# EAGLE schematic Solo_MultiCharger (EAGLE 6.6.0)
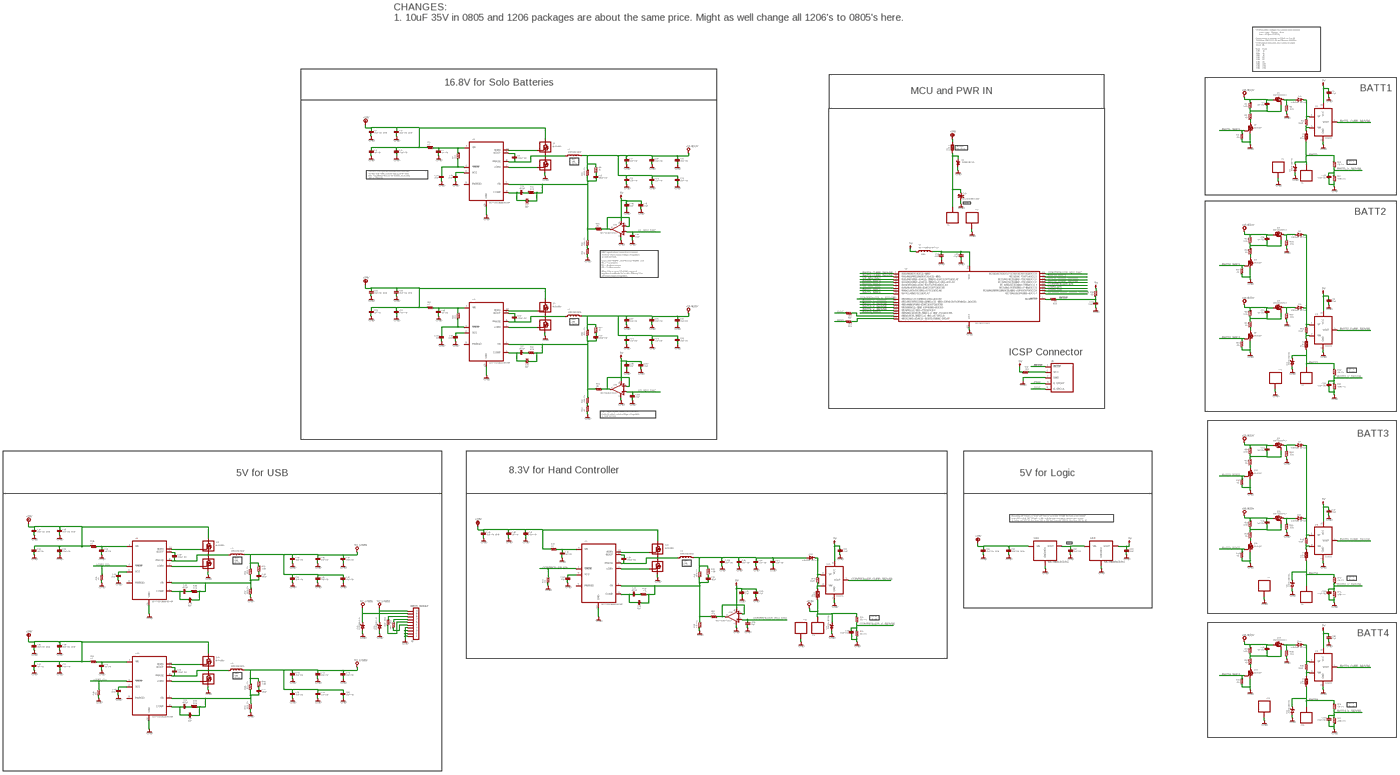
[diagram p0: schematic, sheet 1, overview]
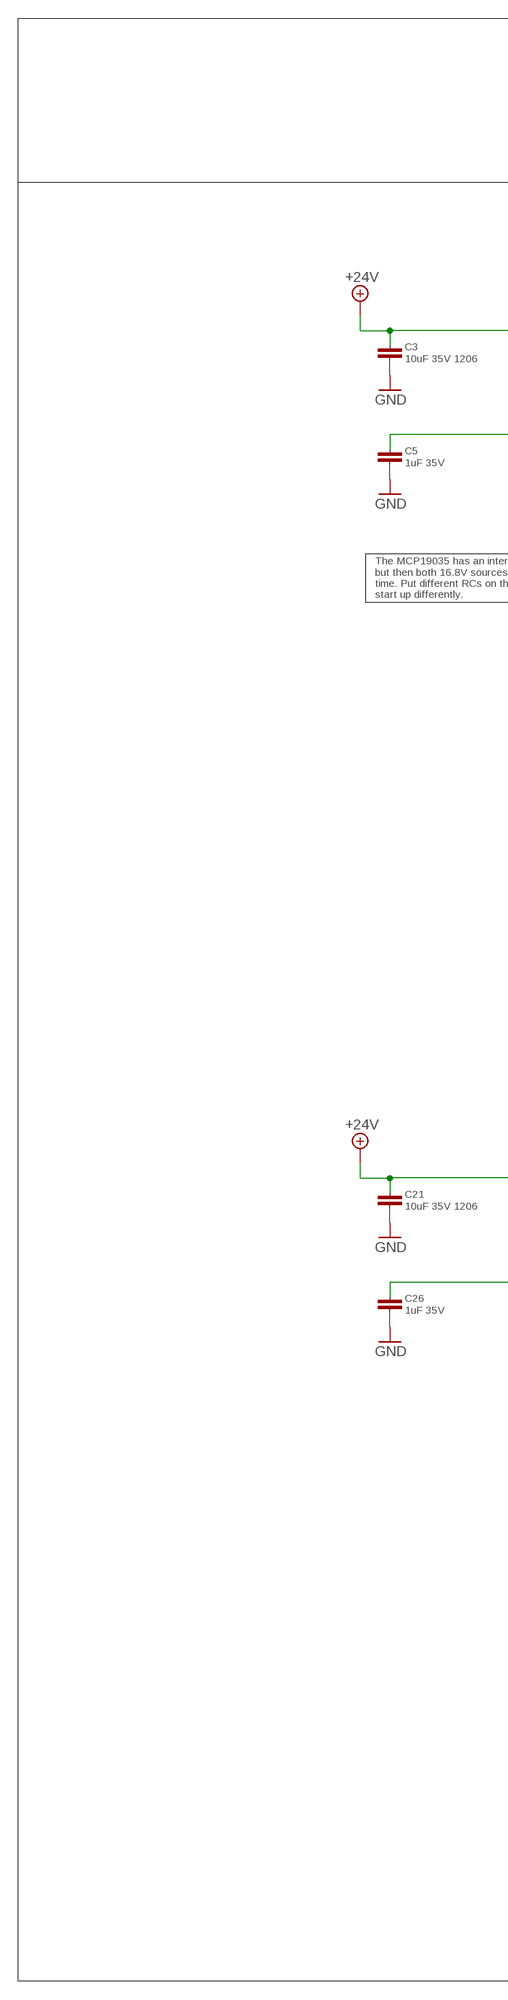
[diagram p1: schematic, sheet 1, part 1 of 8]
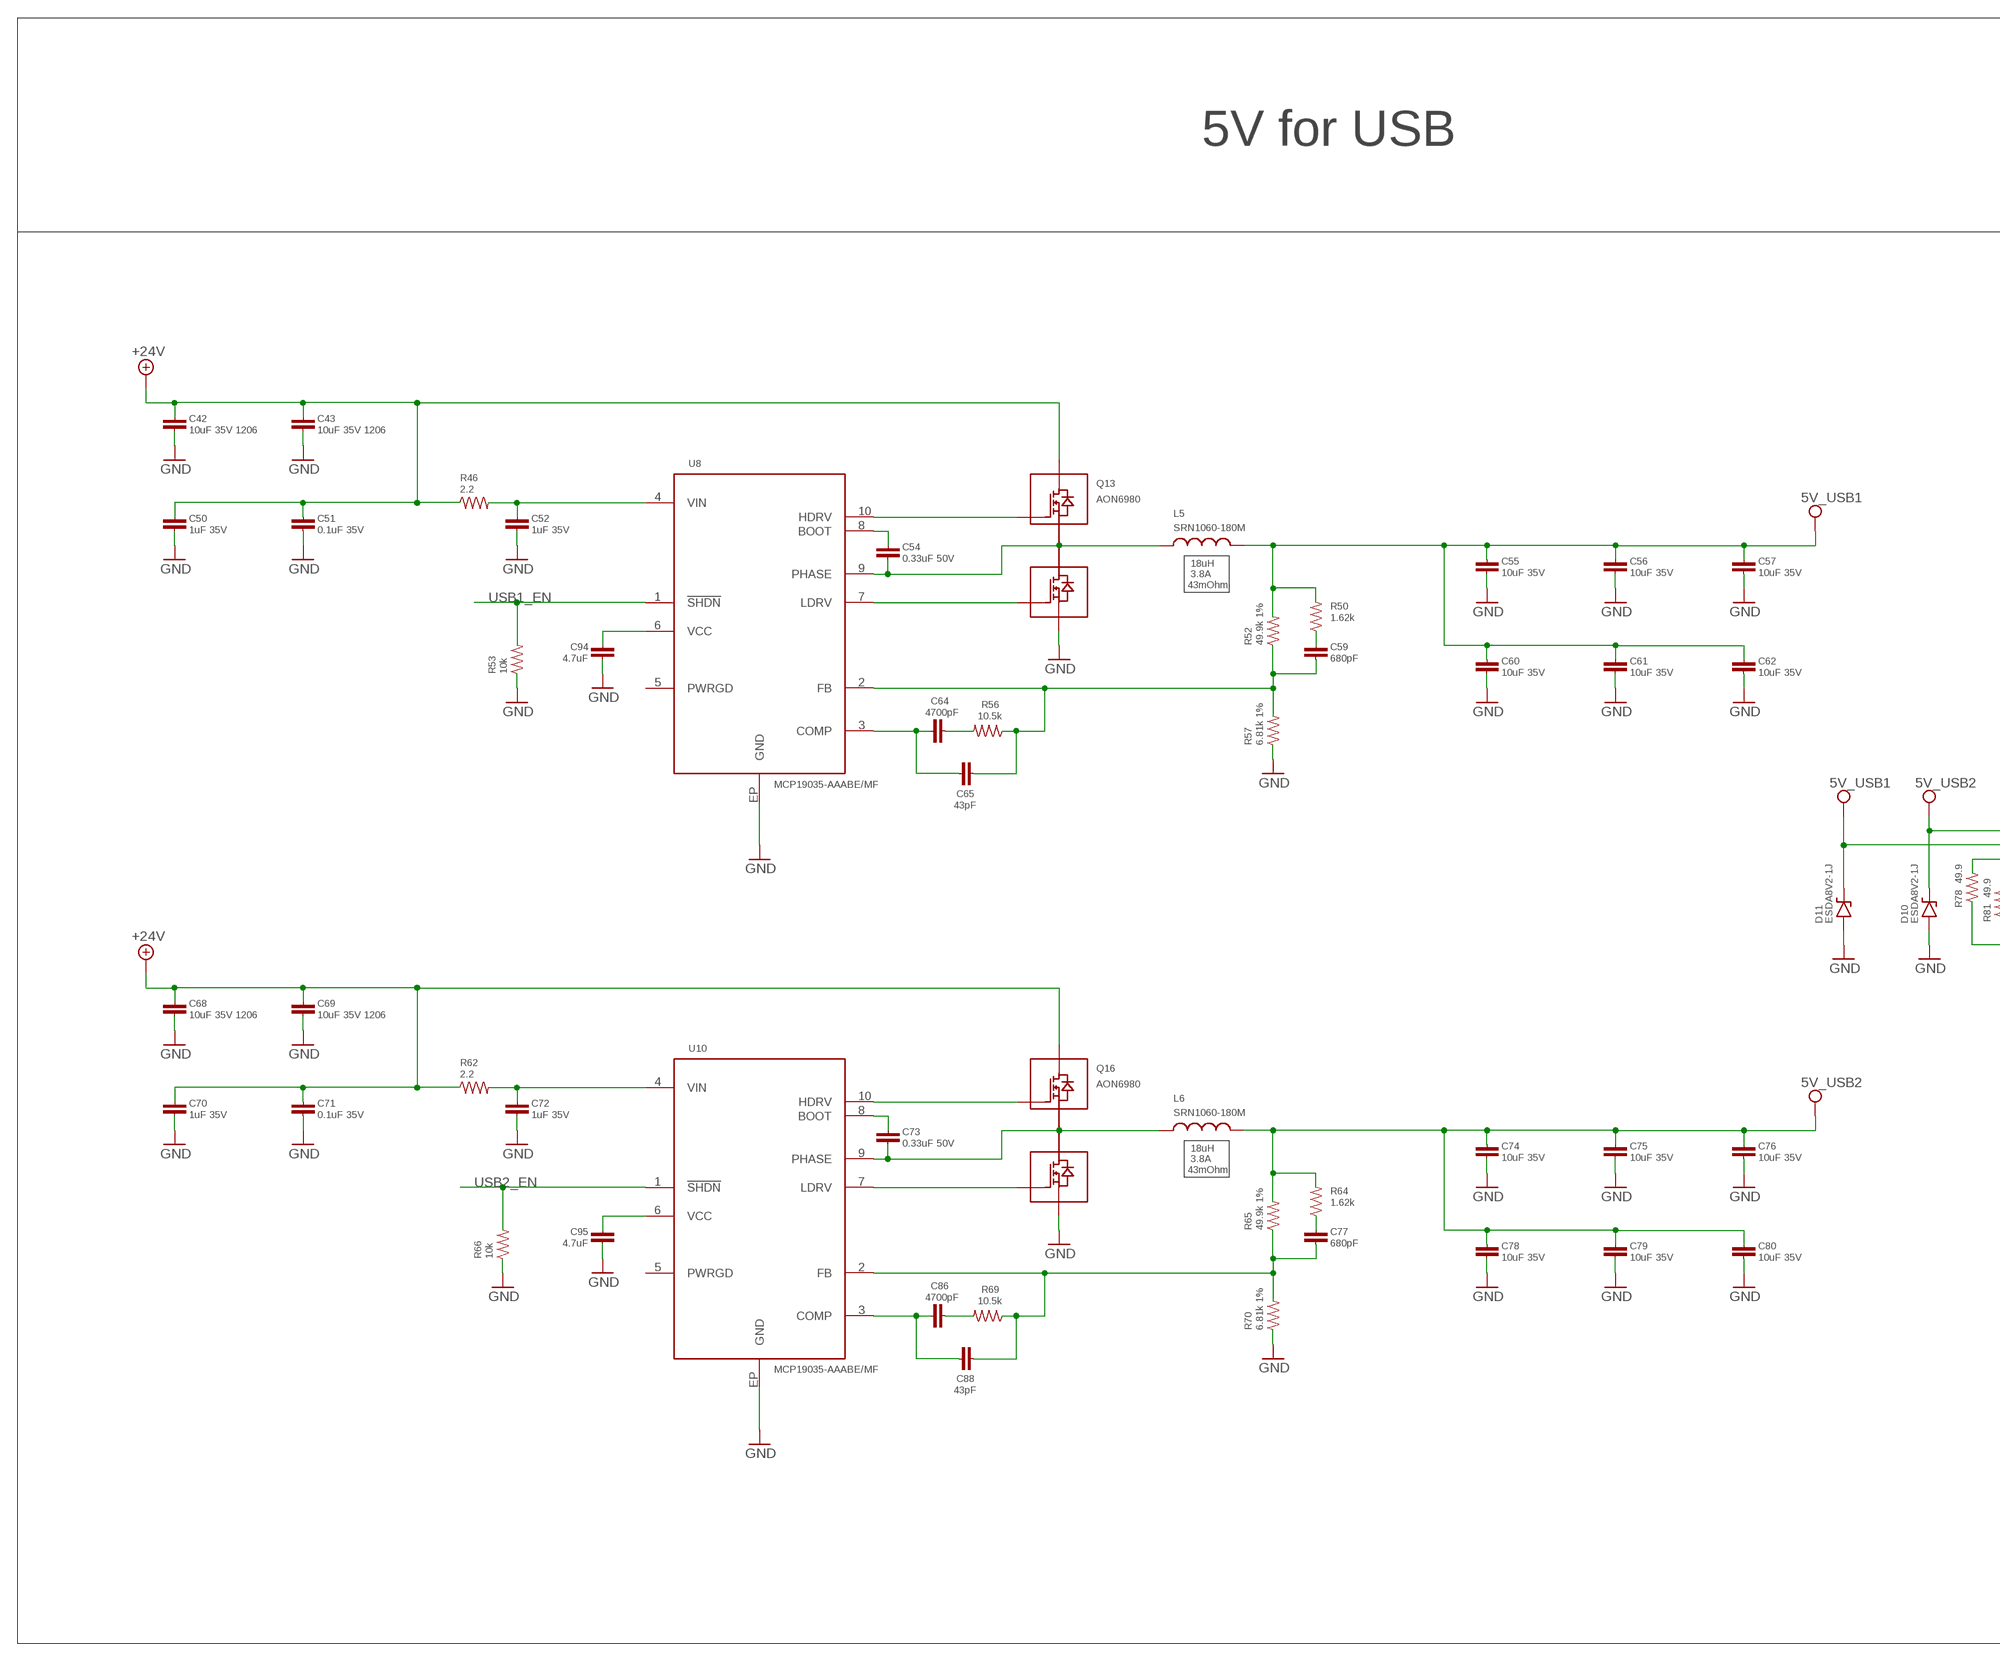
[diagram p2: schematic, sheet 1, part 2 of 8]
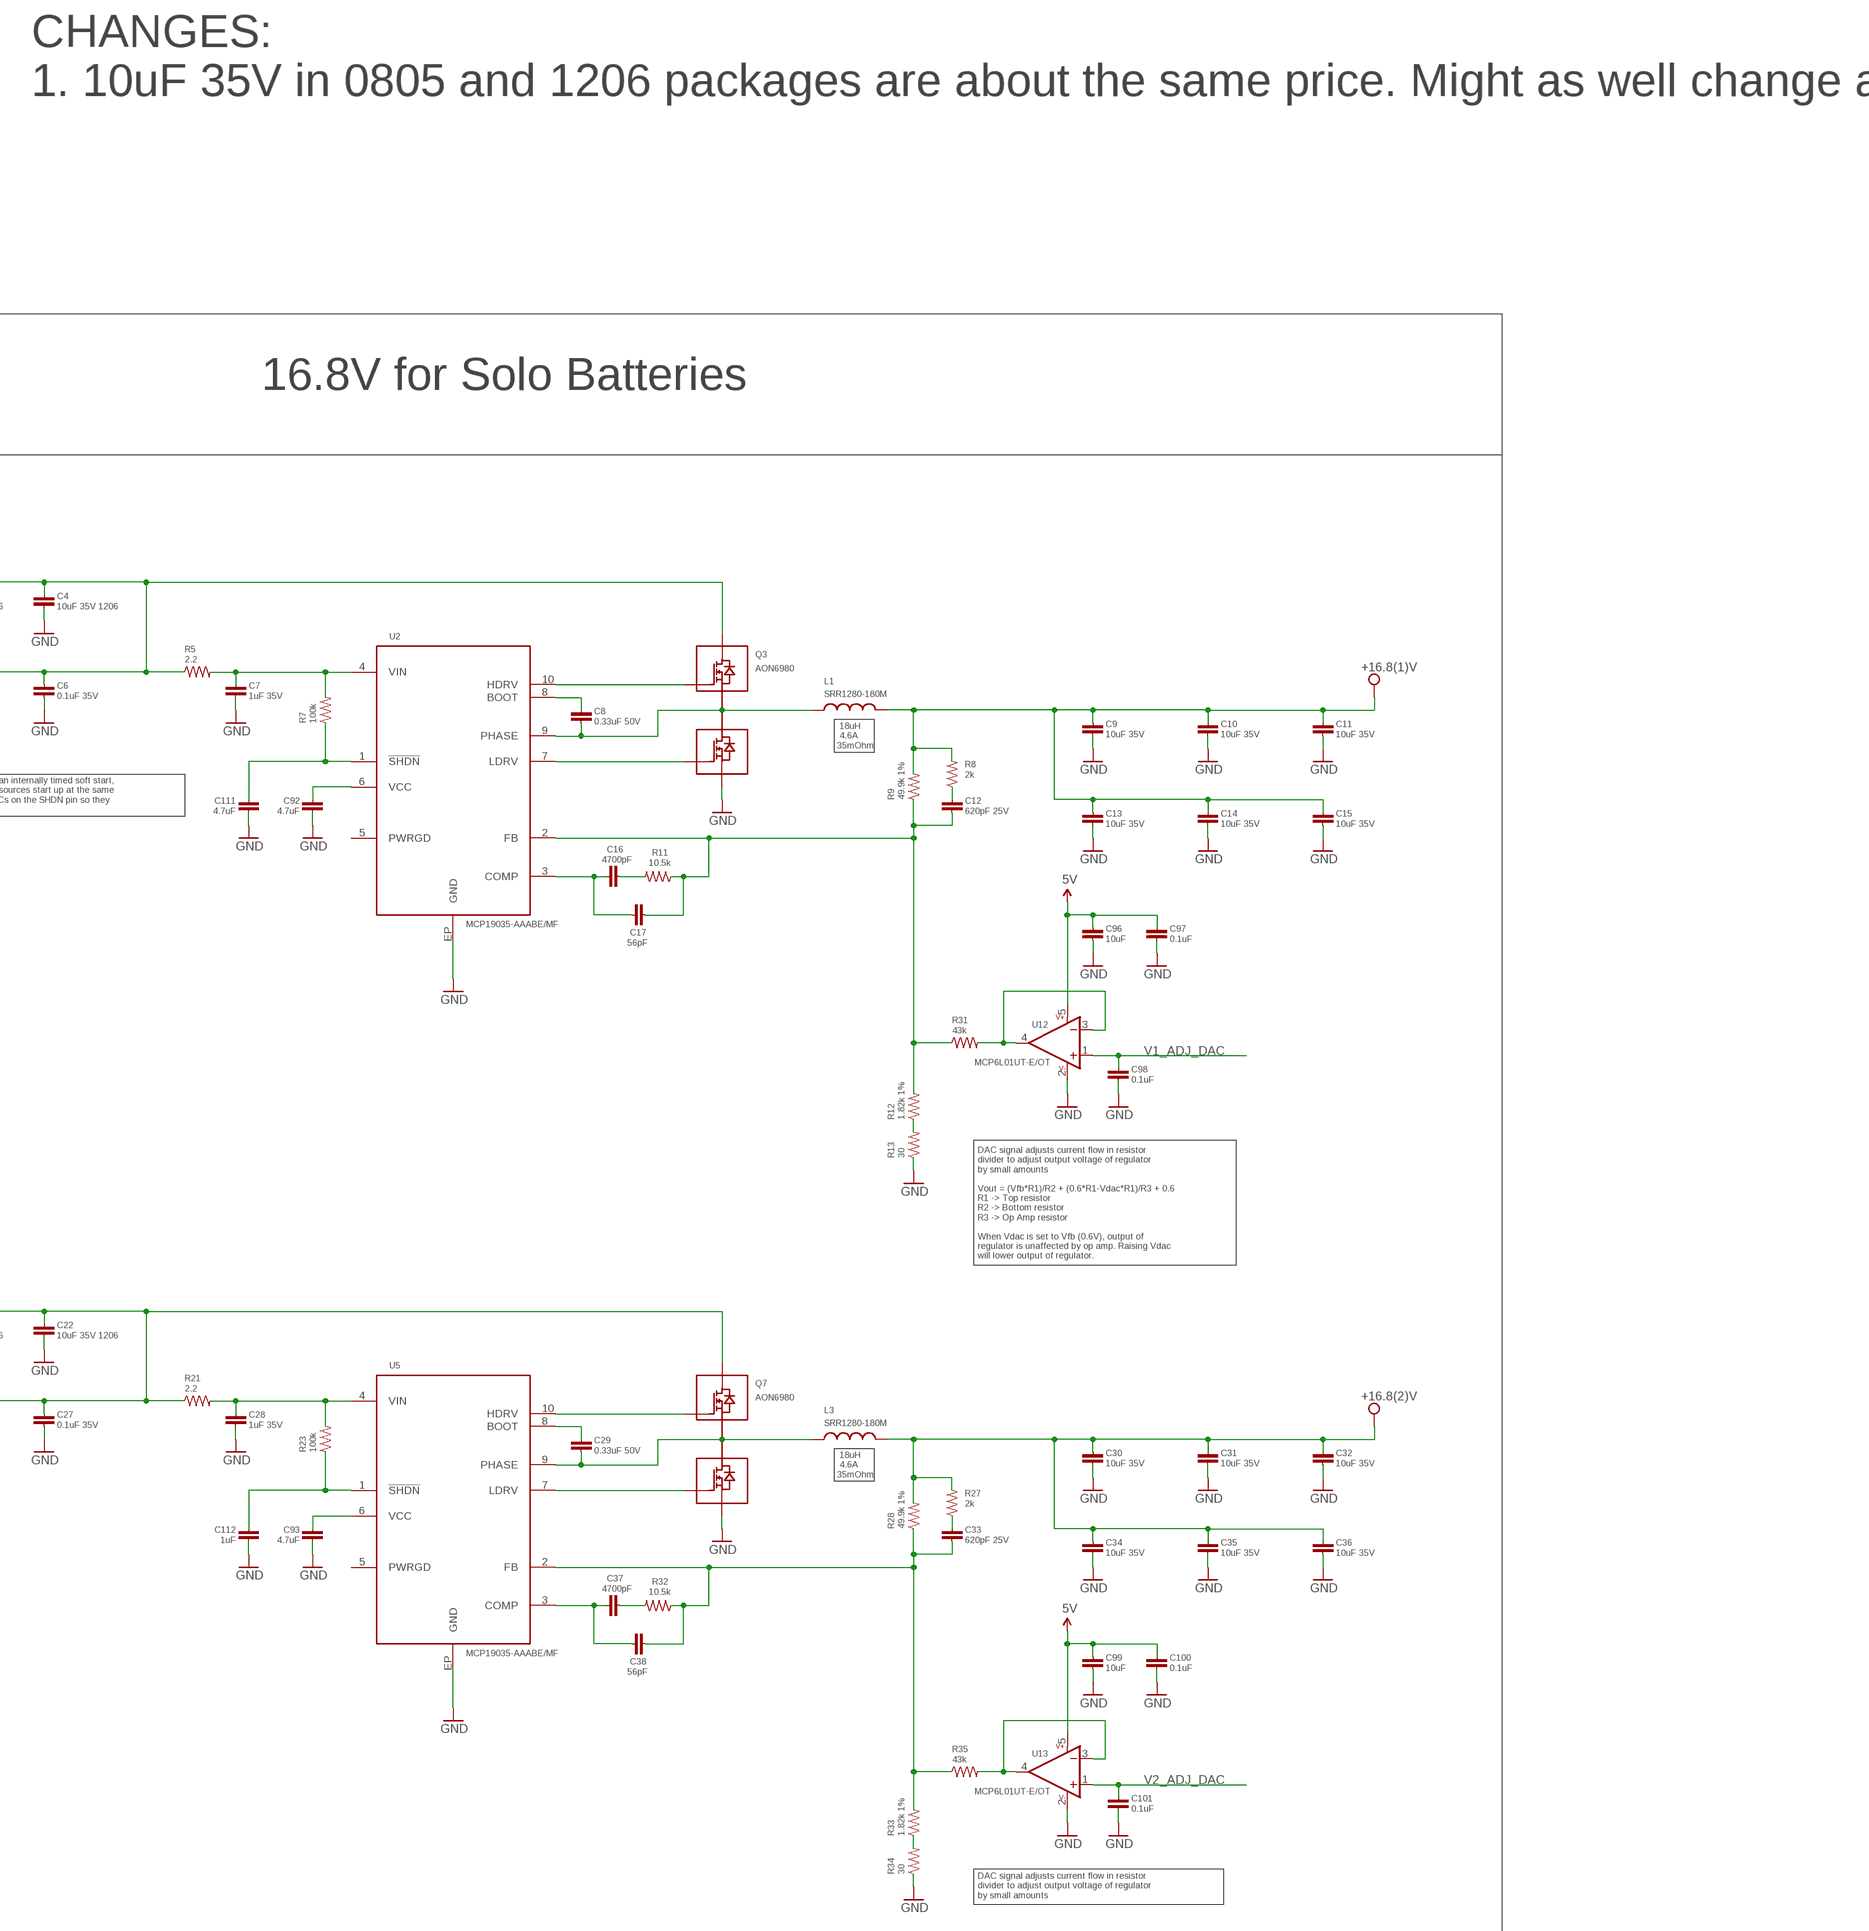
[diagram p3: schematic, sheet 1, part 3 of 8]
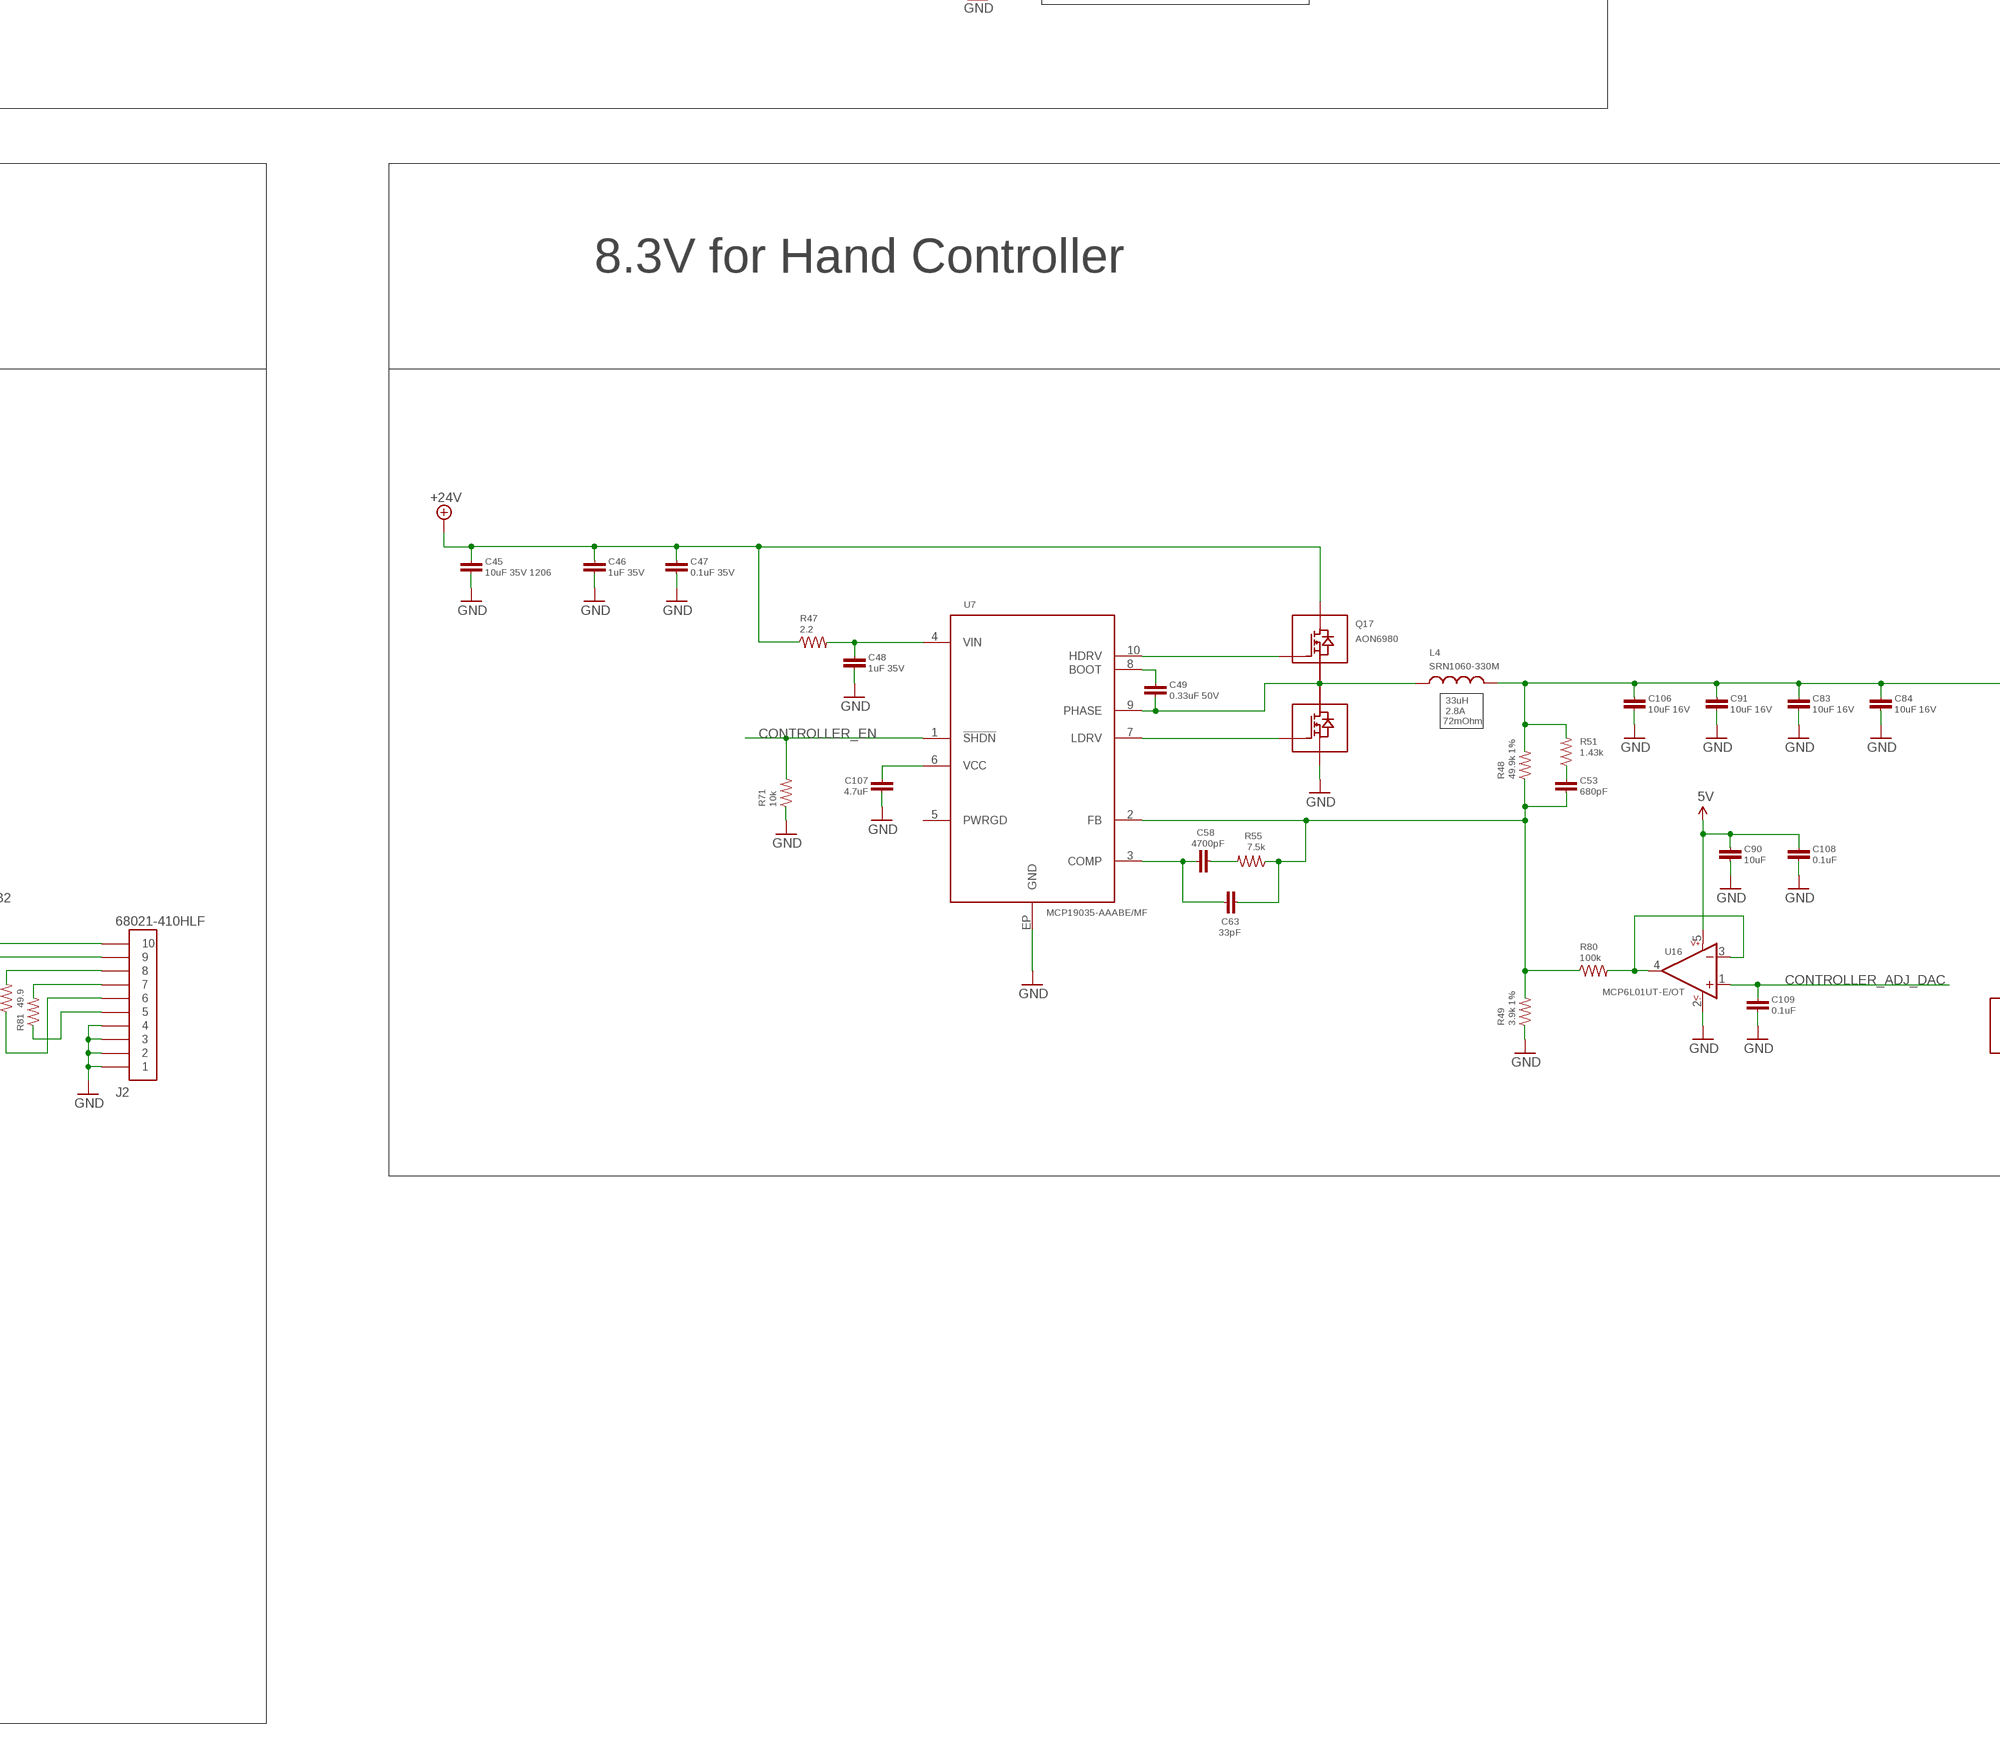
[diagram p4: schematic, sheet 1, part 4 of 8]
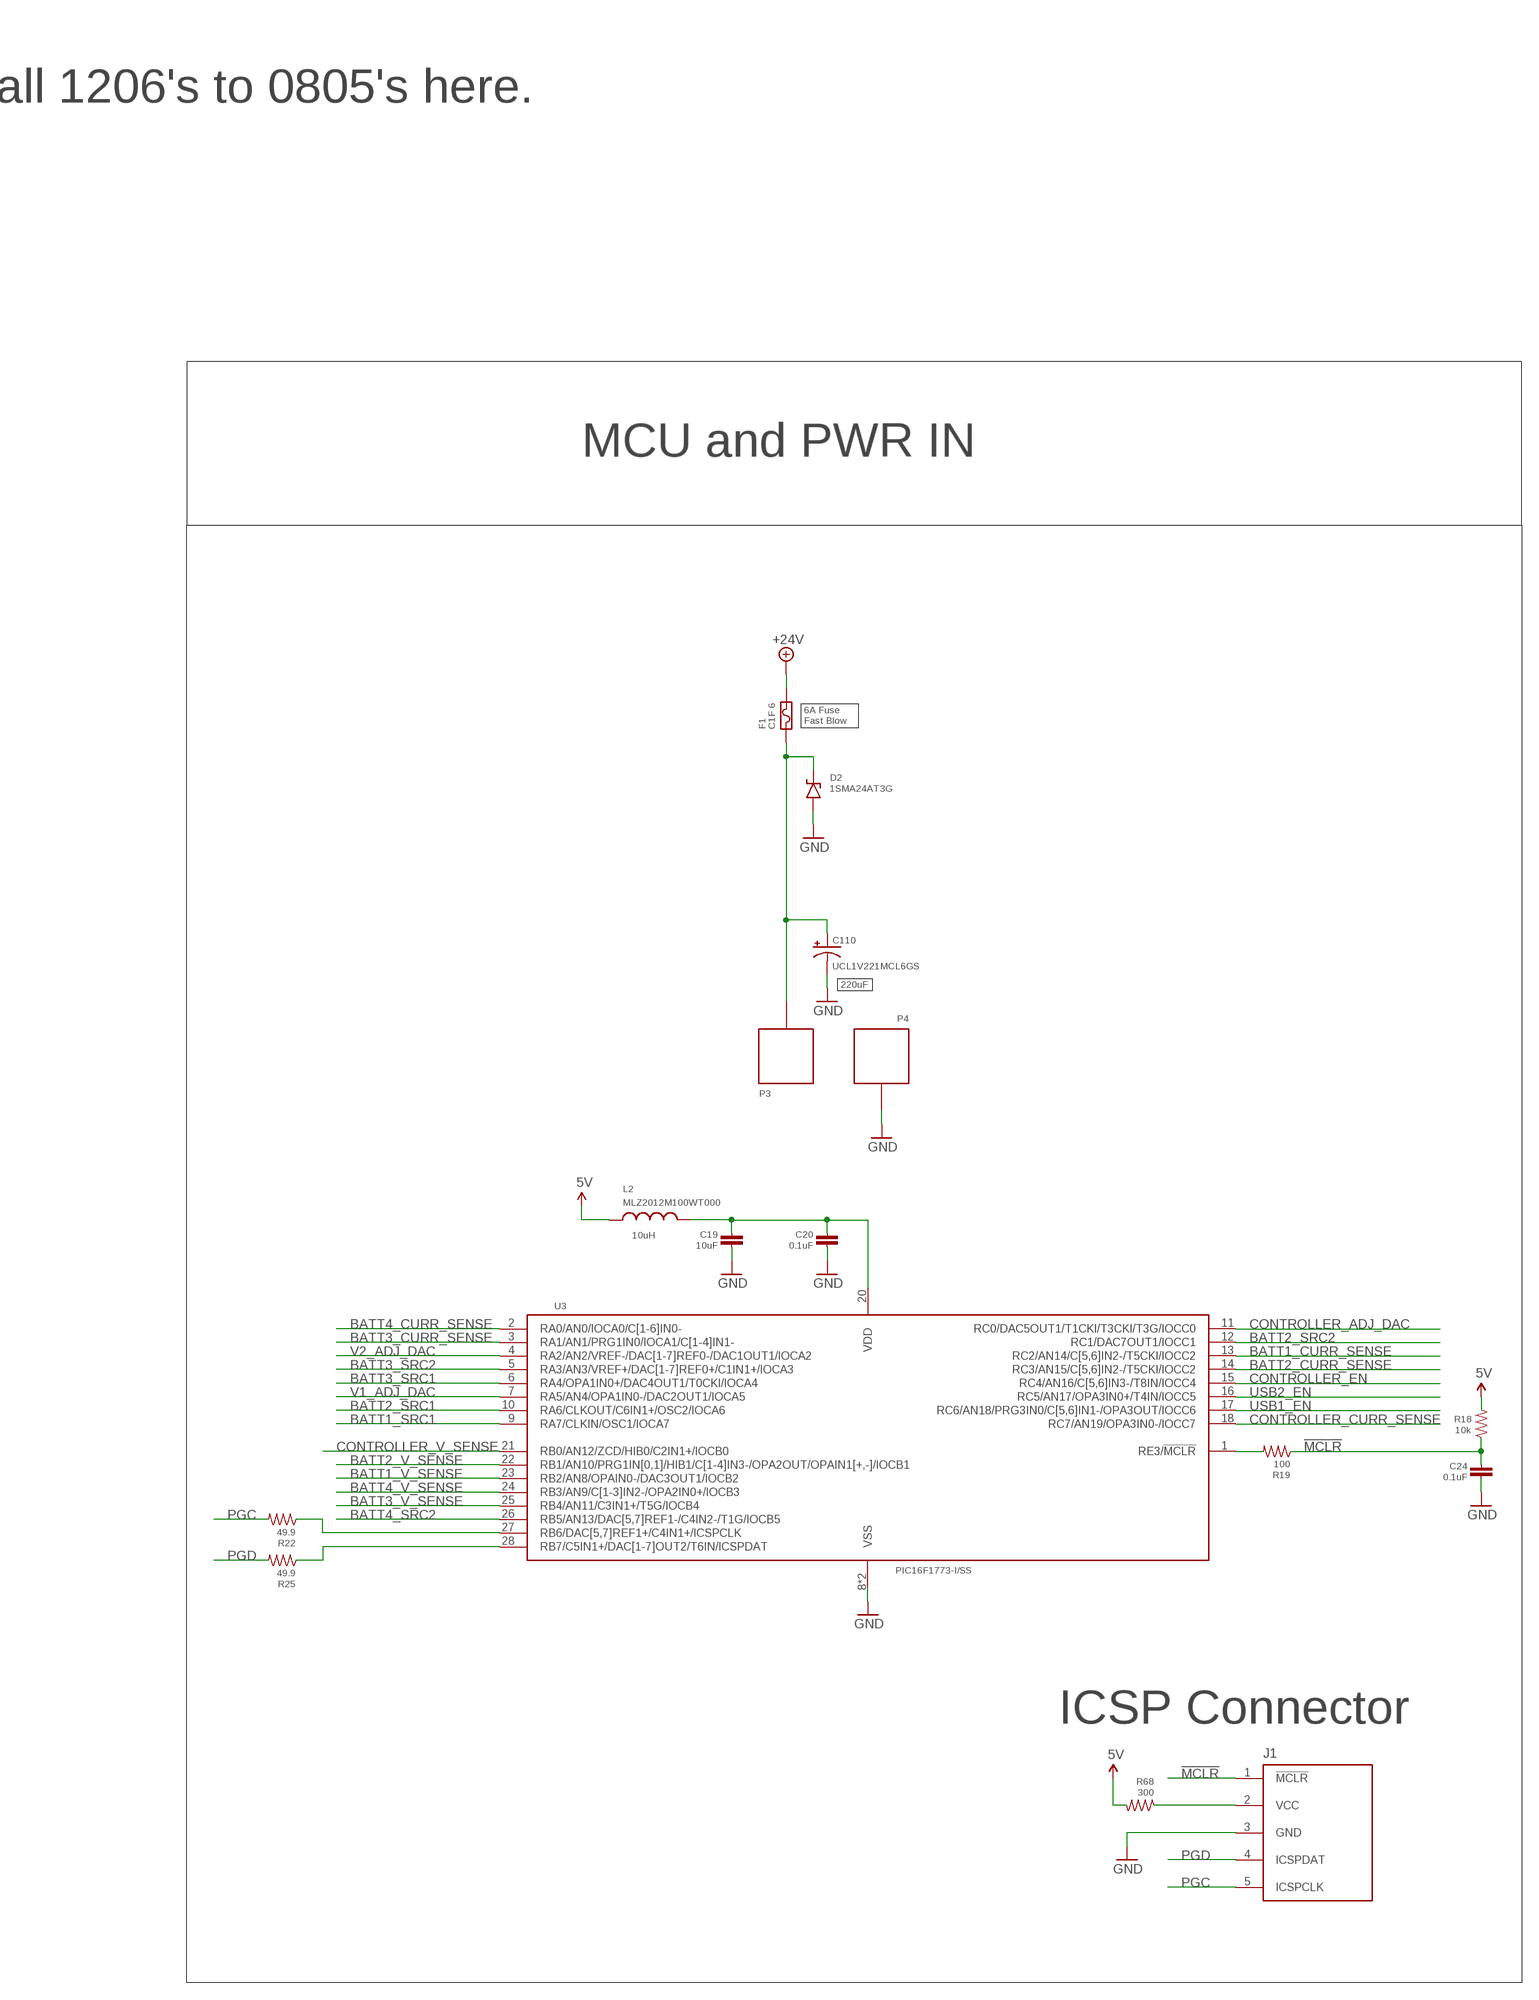
[diagram p5: schematic, sheet 1, part 5 of 8]
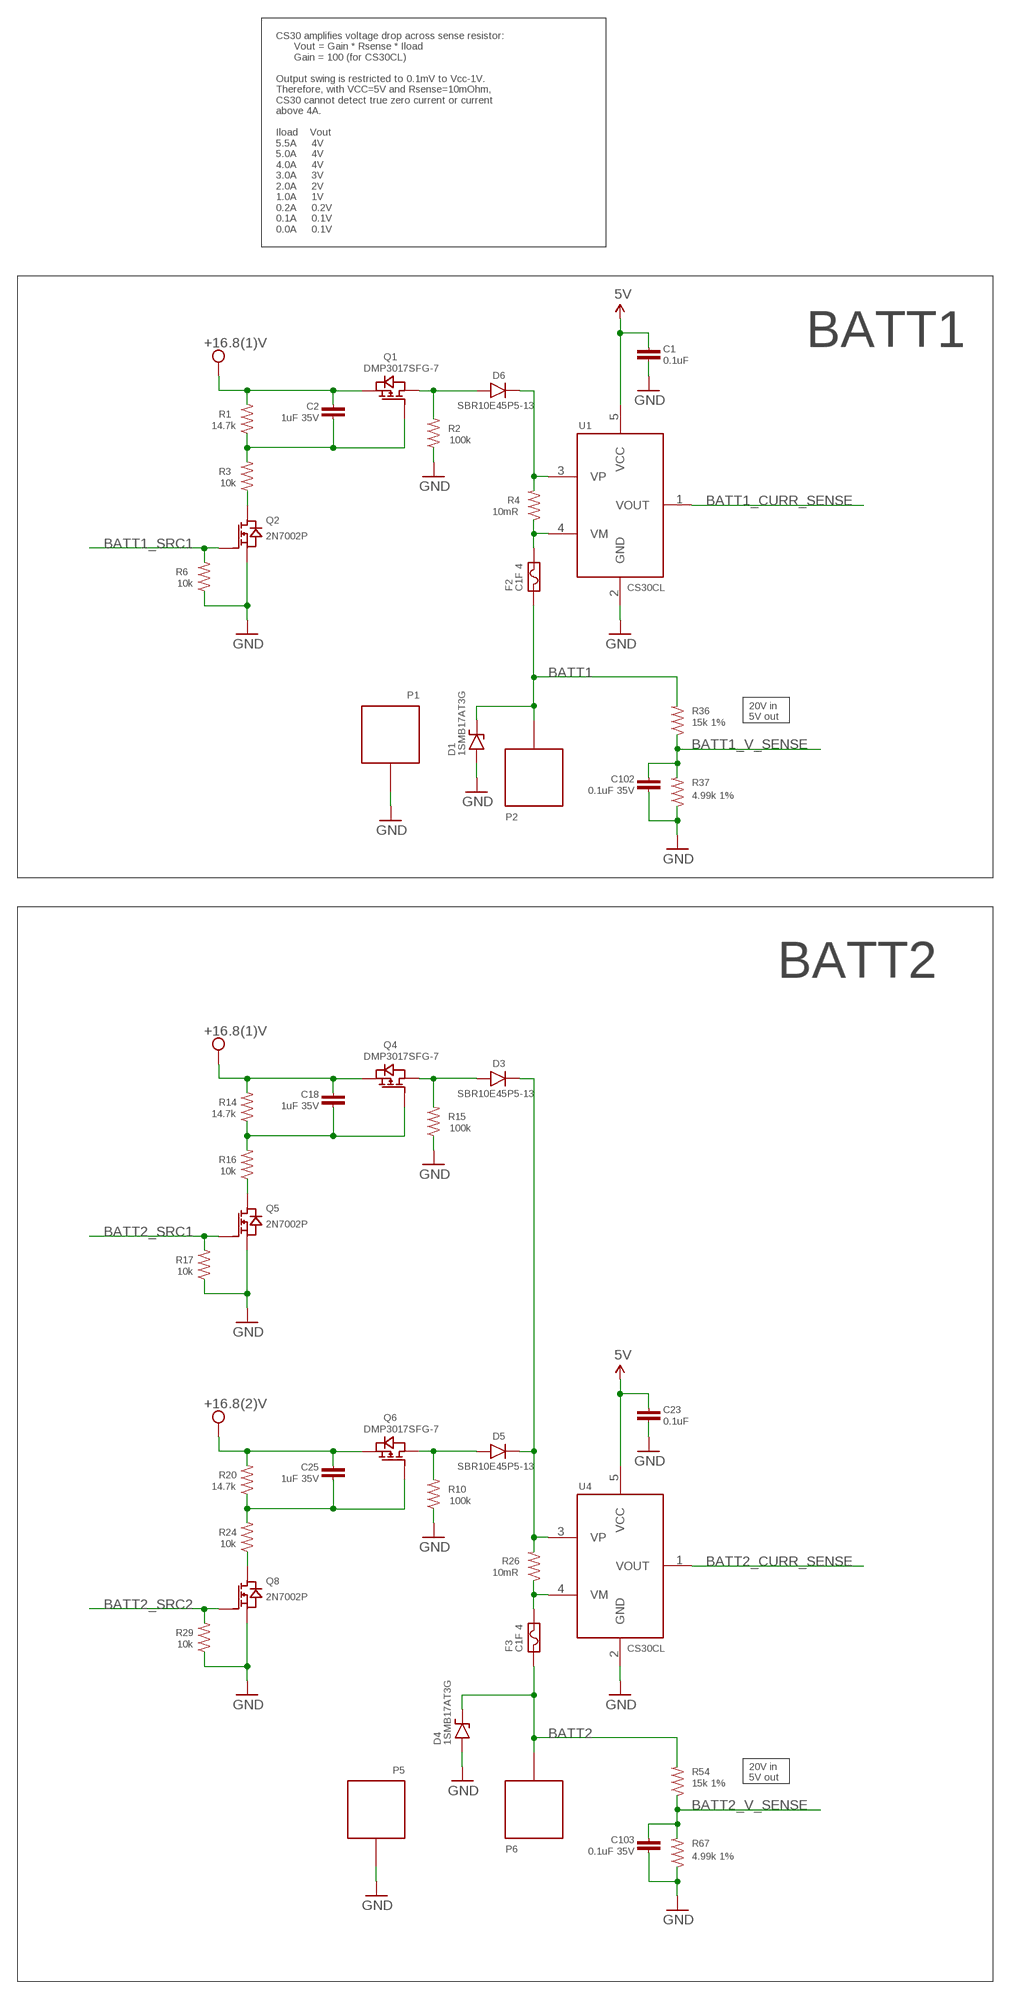
[diagram p6: schematic, sheet 1, part 6 of 8]
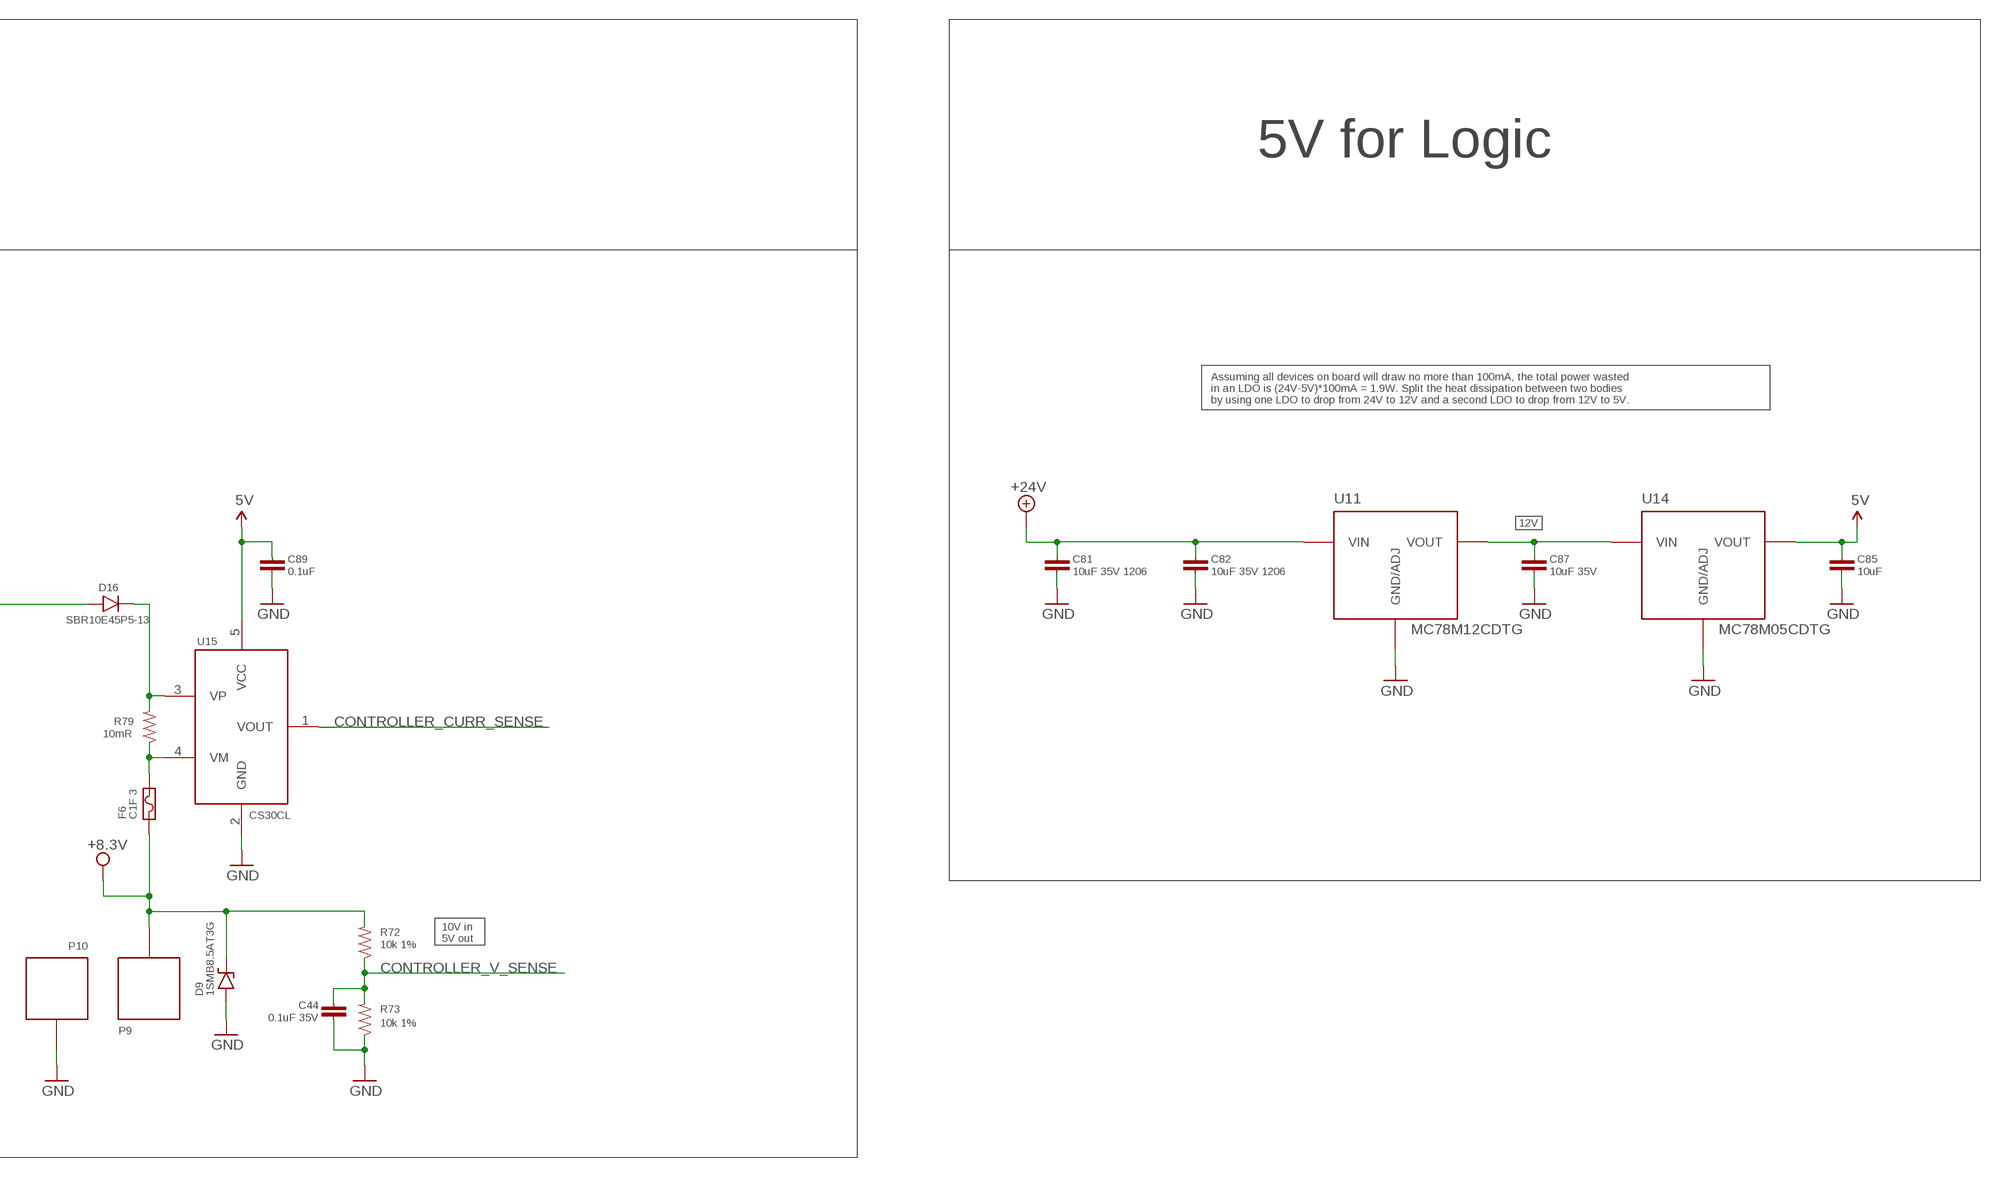
[diagram p7: schematic, sheet 1, part 7 of 8]
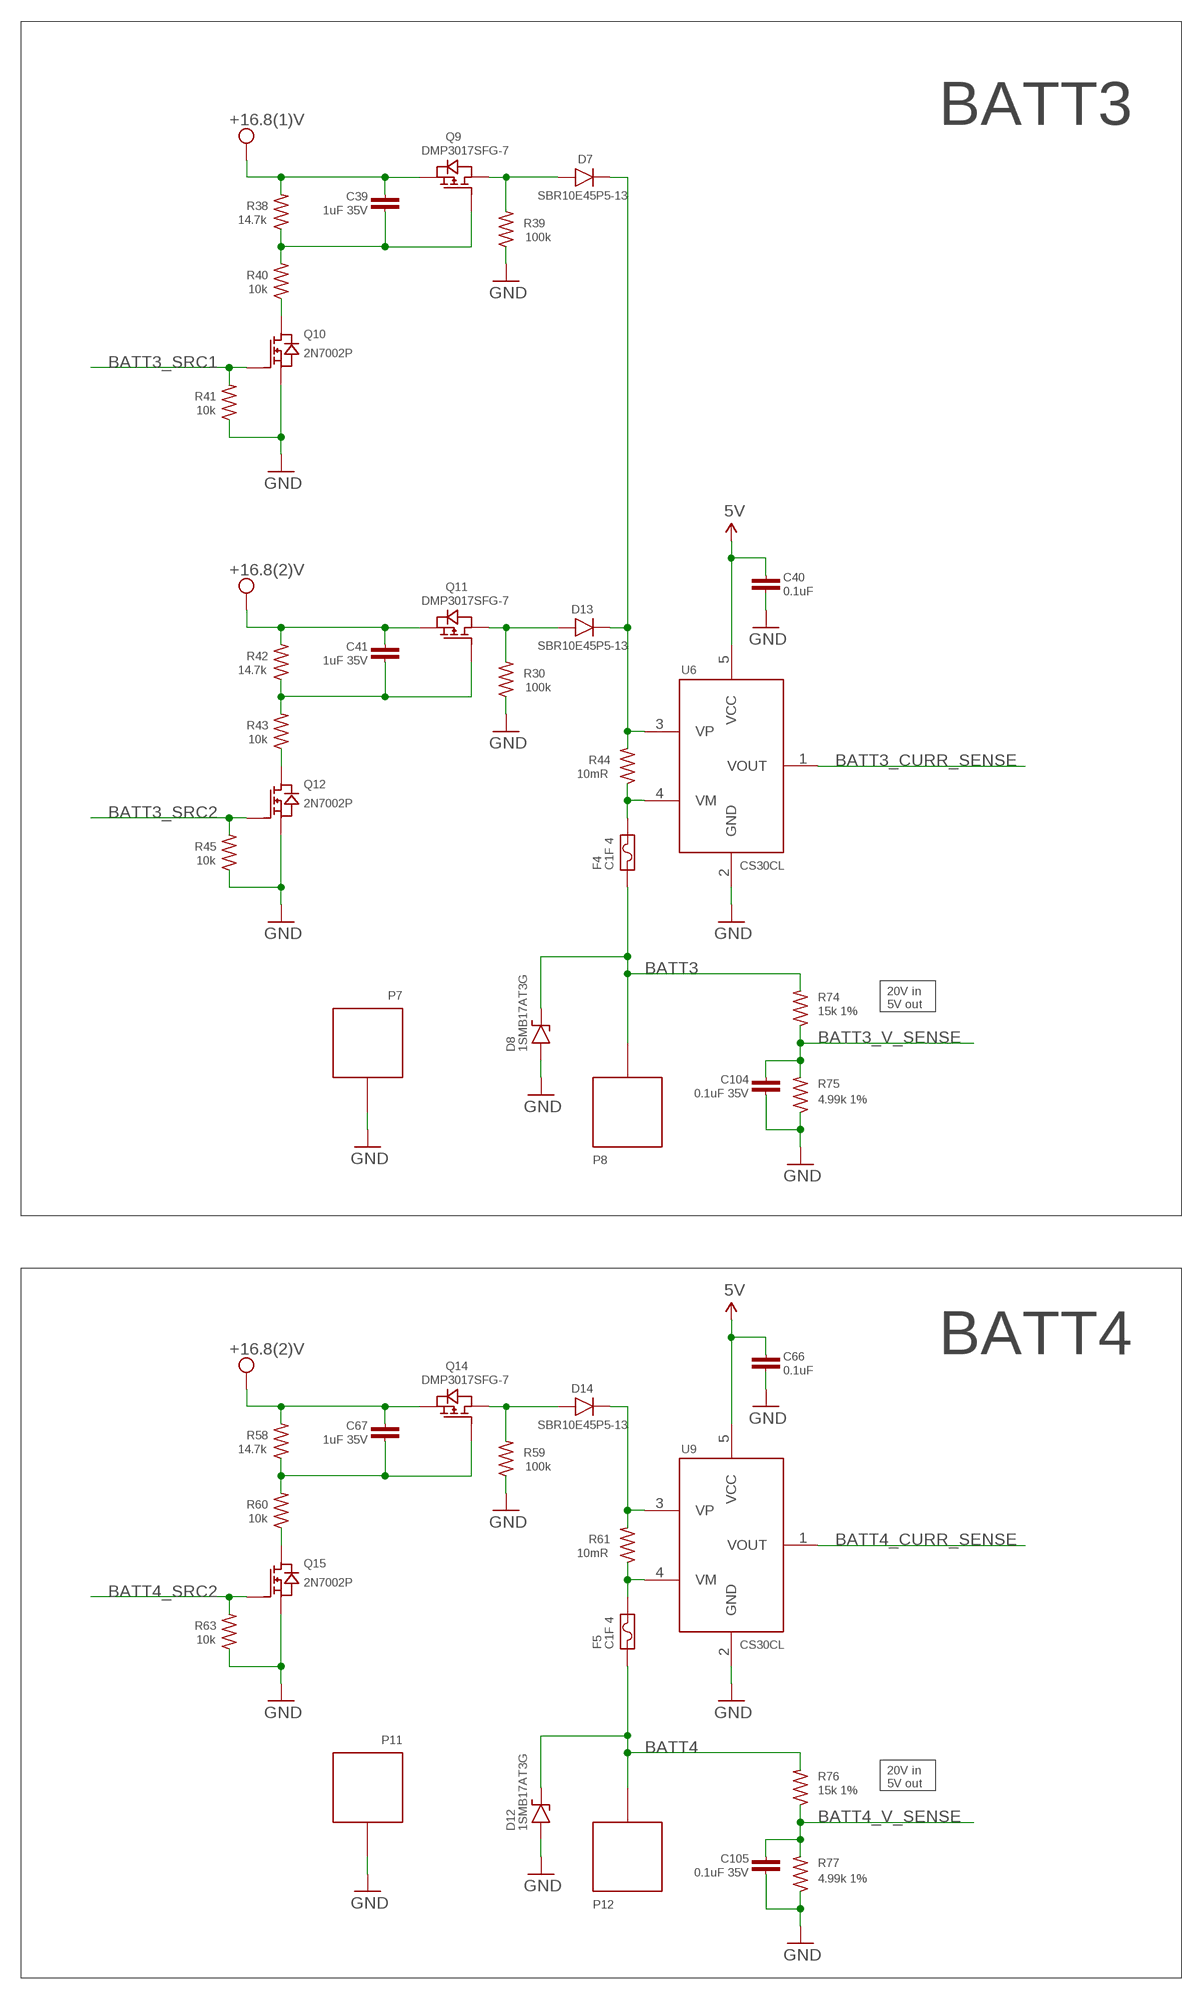
[diagram p8: schematic, sheet 1, part 8 of 8]

## Parts
C1  0.1uF  CAP_(4)  [0805]
C2  1uF 35V  CAP_(4)  [0805]
C3  10uF 35V 1206  CAP_(5)  [1206]
C4  10uF 35V 1206  CAP_(5)  [1206]
C5  1uF 35V  CAP_(4)  [0805]
C6  0.1uF 35V  CAP_(4)  [0805]
C7  1uF 35V  CAP_(4)  [0805]
C8  0.33uF 50V  CAP_(4)  [0805]
C9  10uF 35V  CAP_(4)  [0805]
C10  10uF 35V  CAP_(4)  [0805]
C11  10uF 35V  CAP_(4)  [0805]
C12  620pF 25V  CAP_(4)  [0805]
C13  10uF 35V  CAP_(4)  [0805]
C14  10uF 35V  CAP_(4)  [0805]
C15  10uF 35V  CAP_(4)  [0805]
C16  4700pF  CAP_(4)  [0805]
C17  56pF  CAP_(4)  [0805]
C18  1uF 35V  CAP_(4)  [0805]
C19  10uF  CAP_(4)  [0805]
C20  0.1uF  CAP_(4)  [0805]
C21  10uF 35V 1206  CAP_(5)  [1206]
C22  10uF 35V 1206  CAP_(5)  [1206]
C23  0.1uF  CAP_(4)  [0805]
C24  0.1uF  CAP_(4)  [0805]
C25  1uF 35V  CAP_(4)  [0805]
C26  1uF 35V  CAP_(4)  [0805]
C27  0.1uF 35V  CAP_(4)  [0805]
C28  1uF 35V  CAP_(4)  [0805]
C29  0.33uF 50V  CAP_(4)  [0805]
C30  10uF 35V  CAP_(4)  [0805]
C31  10uF 35V  CAP_(4)  [0805]
C32  10uF 35V  CAP_(4)  [0805]
C33  620pF 25V  CAP_(4)  [0805]
C34  10uF 35V  CAP_(4)  [0805]
C35  10uF 35V  CAP_(4)  [0805]
C36  10uF 35V  CAP_(4)  [0805]
C37  4700pF  CAP_(4)  [0805]
C38  56pF  CAP_(4)  [0805]
C39  1uF 35V  CAP_(4)  [0805]
C40  0.1uF  CAP_(4)  [0805]
C41  1uF 35V  CAP_(4)  [0805]
C42  10uF 35V 1206  CAP_(5)  [1206]
C43  10uF 35V 1206  CAP_(5)  [1206]
C44  0.1uF 35V  CAP_(4)  [0805]
C45  10uF 35V 1206  CAP_(5)  [1206]
C46  1uF 35V  CAP_(4)  [0805]
C47  0.1uF 35V  CAP_(4)  [0805]
C48  1uF 35V  CAP_(4)  [0805]
C49  0.33uF 50V  CAP_(4)  [0805]
C50  1uF 35V  CAP_(4)  [0805]
C51  0.1uF 35V  CAP_(4)  [0805]
C52  1uF 35V  CAP_(4)  [0805]
C53  680pF  CAP_(4)  [0805]
C54  0.33uF 50V  CAP_(4)  [0805]
C55  10uF 35V  CAP_(4)  [0805]
C56  10uF 35V  CAP_(4)  [0805]
C57  10uF 35V  CAP_(4)  [0805]
C58  4700pF  CAP_(4)  [0805]
C59  680pF  CAP_(4)  [0805]
C60  10uF 35V  CAP_(4)  [0805]
C61  10uF 35V  CAP_(4)  [0805]
C62  10uF 35V  CAP_(4)  [0805]
C63  33pF  CAP_(4)  [0805]
C64  4700pF  CAP_(4)  [0805]
C65  43pF  CAP_(4)  [0805]
C66  0.1uF  CAP_(4)  [0805]
C67  1uF 35V  CAP_(4)  [0805]
C68  10uF 35V 1206  CAP_(5)  [1206]
C69  10uF 35V 1206  CAP_(5)  [1206]
C70  1uF 35V  CAP_(4)  [0805]
C71  0.1uF 35V  CAP_(4)  [0805]
C72  1uF 35V  CAP_(4)  [0805]
C73  0.33uF 50V  CAP_(4)  [0805]
C74  10uF 35V  CAP_(4)  [0805]
C75  10uF 35V  CAP_(4)  [0805]
C76  10uF 35V  CAP_(4)  [0805]
C77  680pF  CAP_(4)  [0805]
C78  10uF 35V  CAP_(4)  [0805]
C79  10uF 35V  CAP_(4)  [0805]
C80  10uF 35V  CAP_(4)  [0805]
C81  10uF 35V 1206  CAP_(5)  [1206]
C82  10uF 35V 1206  CAP_(5)  [1206]
C83  10uF 16V  CAP_(4)  [0805]
C84  10uF 16V  CAP_(4)  [0805]
C85  10uF  CAP_(4)  [0805]
C86  4700pF  CAP_(4)  [0805]
C87  10uF 35V  CAP_(4)  [0805]
C88  43pF  CAP_(4)  [0805]
C89  0.1uF  CAP_(4)  [0805]
C90  10uF  CAP_(4)  [0805]
C91  10uF 16V  CAP_(4)  [0805]
C92  4.7uF  CAP_(4)  [0805]
C93  4.7uF  CAP_(4)  [0805]
C94  4.7uF  CAP_(4)  [0805]
C95  4.7uF  CAP_(4)  [0805]
C96  10uF  CAP_(4)  [0805]
C97  0.1uF  CAP_(4)  [0805]
C98  0.1uF  CAP_(4)  [0805]
C99  10uF  CAP_(4)  [0805]
C100  0.1uF  CAP_(4)  [0805]
C101  0.1uF  CAP_(4)  [0805]
C102  0.1uF 35V  CAP_(4)  [0805]
C103  0.1uF 35V  CAP_(4)  [0805]
C104  0.1uF 35V  CAP_(4)  [0805]
C105  0.1uF 35V  CAP_(4)  [0805]
C106  10uF 16V  CAP_(4)  [0805]
C107  4.7uF  CAP_(4)  [0805]
C108  0.1uF  CAP_(4)  [0805]
C109  0.1uF  CAP_(4)  [0805]
C110  UCL1V221MCL6GS  CAP_POL_(12)  [NICHICON_10MM]
C111  4.7uF  CAP_(4)  [0805]
C112  1uF  CAP_(4)  [0805]
D1  1SMB17AT3G  ZENER_(2)  [DO-214AA]
D2  1SMA24AT3G  ZENER_(4)  [DO-214AC]
D3  SBR10E45P5-13  DIODE_(4)  [POWERDI-5]
D4  1SMB17AT3G  ZENER_(2)  [DO-214AA]
D5  SBR10E45P5-13  DIODE_(4)  [POWERDI-5]
D6  SBR10E45P5-13  DIODE_(4)  [POWERDI-5]
D7  SBR10E45P5-13  DIODE_(4)  [POWERDI-5]
D8  1SMB17AT3G  ZENER_(2)  [DO-214AA]
D9  1SMB8.5AT3G  ZENER_(2)  [DO-214AA]
D10  ESDA8V2-1J  ZENER_(5)  [SOD-323]
D11  ESDA8V2-1J  ZENER_(5)  [SOD-323]
D12  1SMB17AT3G  ZENER_(2)  [DO-214AA]
D13  SBR10E45P5-13  DIODE_(4)  [POWERDI-5]
D14  SBR10E45P5-13  DIODE_(4)  [POWERDI-5]
D16  SBR10E45P5-13  DIODE_(4)  [POWERDI-5]
F1  C1F 6  FUSE_(2)  [1206]
F2  C1F 4  FUSE_(2)  [1206]
F3  C1F 4  FUSE_(2)  [1206]
F4  C1F 4  FUSE_(2)  [1206]
F5  C1F 4  FUSE_(2)  [1206]
F6  C1F 3  FUSE_(2)  [1206]
J1  PIC_ICSP_5PIN  [SULLINS_XPXC_5PIN]
J2  68021-410HLF  CON_10PIN_(3)  [CON_100MIL_2X5]
L1  SRR1280-180M  INDUCTOR_(B6)  [BOURNS_SRR1280]
L2  MLZ2012M100WT000  INDUCTOR_(3)  [0805]
L3  SRR1280-180M  INDUCTOR_(B6)  [BOURNS_SRR1280]
L4  SRN1060-330M  INDUCTOR_(B1)  [BOURNS_SRN1060]
L5  SRN1060-180M  INDUCTOR_(B1)  [BOURNS_SRN1060]
L6  SRN1060-180M  INDUCTOR_(B1)  [BOURNS_SRN1060]
P1  SOLDER_PAD_(9)  [SOLDER_PAD_5X8]
P2  SOLDER_PAD_(9)  [SOLDER_PAD_5X8]
P3  SOLDER_PAD_(9)  [SOLDER_PAD_5X8]
P4  SOLDER_PAD_(9)  [SOLDER_PAD_5X8]
P5  SOLDER_PAD_(9)  [SOLDER_PAD_5X8]
P6  SOLDER_PAD_(9)  [SOLDER_PAD_5X8]
P7  SOLDER_PAD_(9)  [SOLDER_PAD_5X8]
P8  SOLDER_PAD_(9)  [SOLDER_PAD_5X8]
P9  SOLDER_PAD_(9)  [SOLDER_PAD_5X8]
P10  SOLDER_PAD_(9)  [SOLDER_PAD_5X8]
P11  SOLDER_PAD_(9)  [SOLDER_PAD_5X8]
P12  SOLDER_PAD_(9)  [SOLDER_PAD_5X8]
Q1  DMP3017SFG-7  PMOS_SSSGDDDD(3)  [POWERVDFN-8]
Q2  2N7002P  NMOS_GSD(1)  [SOT-23-3]
Q3  AON6980  NMOS_HALFBRIDGE  [DFN5X6B_8L_EP2_ALPHA&OMEGA]
Q4  DMP3017SFG-7  PMOS_SSSGDDDD(3)  [POWERVDFN-8]
Q5  2N7002P  NMOS_GSD(1)  [SOT-23-3]
Q6  DMP3017SFG-7  PMOS_SSSGDDDD(3)  [POWERVDFN-8]
Q7  AON6980  NMOS_HALFBRIDGE  [DFN5X6B_8L_EP2_ALPHA&OMEGA]
Q8  2N7002P  NMOS_GSD(1)  [SOT-23-3]
Q9  DMP3017SFG-7  PMOS_SSSGDDDD(3)  [POWERVDFN-8]
Q10  2N7002P  NMOS_GSD(1)  [SOT-23-3]
Q11  DMP3017SFG-7  PMOS_SSSGDDDD(3)  [POWERVDFN-8]
Q12  2N7002P  NMOS_GSD(1)  [SOT-23-3]
Q13  AON6980  NMOS_HALFBRIDGE  [DFN5X6B_8L_EP2_ALPHA&OMEGA]
Q14  DMP3017SFG-7  PMOS_SSSGDDDD(3)  [POWERVDFN-8]
Q15  2N7002P  NMOS_GSD(1)  [SOT-23-3]
Q16  AON6980  NMOS_HALFBRIDGE  [DFN5X6B_8L_EP2_ALPHA&OMEGA]
Q17  AON6980  NMOS_HALFBRIDGE  [DFN5X6B_8L_EP2_ALPHA&OMEGA]
R1  14.7k  RESISTOR_(7)  [0805]
R2  100k  RESISTOR_(7)  [0805]
R3  10k  RESISTOR_(7)  [0805]
R4  10mR  RESISTOR_(7)  [0805]
R5  2.2  RESISTOR_(7)  [0805]
R6  10k  RESISTOR_(7)  [0805]
R7  100k  RESISTOR_(7)  [0805]
R8  2k  RESISTOR_(7)  [0805]
R9  49.9k 1%  RESISTOR_(7)  [0805]
R10  100k  RESISTOR_(7)  [0805]
R11  10.5k  RESISTOR_(7)  [0805]
R12  1.82k 1%  RESISTOR_(7)  [0805]
R13  30  RESISTOR_(7)  [0805]
R14  14.7k  RESISTOR_(7)  [0805]
R15  100k  RESISTOR_(7)  [0805]
R16  10k  RESISTOR_(7)  [0805]
R17  10k  RESISTOR_(7)  [0805]
R18  10k  RESISTOR_(7)  [0805]
R19  100  RESISTOR_(7)  [0805]
R20  14.7k  RESISTOR_(7)  [0805]
R21  2.2  RESISTOR_(7)  [0805]
R22  49.9  RESISTOR_(7)  [0805]
R23  100k  RESISTOR_(7)  [0805]
R24  10k  RESISTOR_(7)  [0805]
R25  49.9  RESISTOR_(7)  [0805]
R26  10mR  RESISTOR_(7)  [0805]
R27  2k  RESISTOR_(7)  [0805]
R28  49.9k 1%  RESISTOR_(7)  [0805]
R29  10k  RESISTOR_(7)  [0805]
R30  100k  RESISTOR_(7)  [0805]
R31  43k  RESISTOR_(7)  [0805]
R32  10.5k  RESISTOR_(7)  [0805]
R33  1.82k 1%  RESISTOR_(7)  [0805]
R34  30  RESISTOR_(7)  [0805]
R35  43k  RESISTOR_(7)  [0805]
R36  15k 1%  RESISTOR_(7)  [0805]
R37  4.99k 1%  RESISTOR_(7)  [0805]
R38  14.7k  RESISTOR_(7)  [0805]
R39  100k  RESISTOR_(7)  [0805]
R40  10k  RESISTOR_(7)  [0805]
R41  10k  RESISTOR_(7)  [0805]
R42  14.7k  RESISTOR_(7)  [0805]
R43  10k  RESISTOR_(7)  [0805]
R44  10mR  RESISTOR_(7)  [0805]
R45  10k  RESISTOR_(7)  [0805]
R46  2.2  RESISTOR_(7)  [0805]
R47  2.2  RESISTOR_(7)  [0805]
R48  49.9k 1%  RESISTOR_(7)  [0805]
R49  3.9k 1%  RESISTOR_(7)  [0805]
R50  1.62k  RESISTOR_(7)  [0805]
R51  1.43k  RESISTOR_(7)  [0805]
R52  49.9k 1%  RESISTOR_(7)  [0805]
R53  10k  RESISTOR_(7)  [0805]
R54  15k 1%  RESISTOR_(7)  [0805]
R55  7.5k  RESISTOR_(7)  [0805]
R56  10.5k  RESISTOR_(7)  [0805]
R57  6.81k 1%  RESISTOR_(7)  [0805]
R58  14.7k  RESISTOR_(7)  [0805]
R59  100k  RESISTOR_(7)  [0805]
R60  10k  RESISTOR_(7)  [0805]
R61  10mR  RESISTOR_(7)  [0805]
R62  2.2  RESISTOR_(7)  [0805]
R63  10k  RESISTOR_(7)  [0805]
R64  1.62k  RESISTOR_(7)  [0805]
R65  49.9k 1%  RESISTOR_(7)  [0805]
R66  10k  RESISTOR_(7)  [0805]
R67  4.99k 1%  RESISTOR_(7)  [0805]
R68  300  RESISTOR_(7)  [0805]
R69  10.5k  RESISTOR_(7)  [0805]
R70  6.81k 1%  RESISTOR_(7)  [0805]
R71  10k  RESISTOR_(7)  [0805]
R72  10k 1%  RESISTOR_(7)  [0805]
R73  10k 1%  RESISTOR_(7)  [0805]
R74  15k 1%  RESISTOR_(7)  [0805]
R75  4.99k 1%  RESISTOR_(7)  [0805]
R76  15k 1%  RESISTOR_(7)  [0805]
R77  4.99k 1%  RESISTOR_(7)  [0805]
R78  49.9  RESISTOR_(7)  [0805]
R79  10mR  RESISTOR_(7)  [0805]
R80  100k  RESISTOR_(7)  [0805]
R81  49.9  RESISTOR_(7)  [0805]
U1  CS30CL  CS30  [SOT-23-5]
U2  MCP19035-AAABE/MF  MCP19035  [VFDFN-10_EP]
U3  PIC16F1773-I/SS  16F1773/6/7/8/9  [SSOP-28]
U4  CS30CL  CS30  [SOT-23-5]
U5  MCP19035-AAABE/MF  MCP19035  [VFDFN-10_EP]
U6  CS30CL  CS30  [SOT-23-5]
U7  MCP19035-AAABE/MF  MCP19035  [VFDFN-10_EP]
U8  MCP19035-AAABE/MF  MCP19035  [VFDFN-10_EP]
U9  CS30CL  CS30  [SOT-23-5]
U10  MCP19035-AAABE/MF  MCP19035  [VFDFN-10_EP]
U11  MC78M12CDTG  LDO_IOG  [TO-252-3]
U12  MCP6L01UT-E/OT  OP-AMP_MCP6L01U  [SOT-23-5]
U13  MCP6L01UT-E/OT  OP-AMP_MCP6L01U  [SOT-23-5]
U14  MC78M05CDTG  LDO_IOG  [TO-252-3]
U15  CS30CL  CS30  [SOT-23-5]
U16  MCP6L01UT-E/OT  OP-AMP_MCP6L01U  [SOT-23-5]

## Nets
5V: C1.1 C23.1 C40.1 C66.1 C85.1 C89.1 C90.1 C96.1 C97.1 C99.1 C100.1 C108.1 L2.1 R18.2 R68.2 U1.5(VCC) U4.5(VCC) U6.5(VCC) U9.5(VCC) U12.5(V+) U13.5(V+) U14.3(VOUT) U15.5(VCC) U16.5(V+)
5V_USB1: C55.1 C56.1 C57.1 C60.1 C61.1 C62.1 D11.C J2.9 L5.2 R50.2 R52.2
5V_USB2: C74.1 C75.1 C76.1 C78.1 C79.1 C80.1 D10.C J2.10 L6.2 R64.2 R65.2
!MCLR: C24.1 J1.1(!MCLR) R18.1 R19.1
+8.3V: D9.C F6.1 P9.1 R72.2
+16.8(1)V: C2.1 C9.1 C10.1 C11.1 C13.1 C14.1 C15.1 C18.1 C39.1 L1.P$2 Q1.1(S) Q1.2(S) Q1.3(S) Q4.1(S) Q4.2(S) Q4.3(S) Q9.1(S) Q9.2(S) Q9.3(S) R1.2 R8.2 R9.2 R14.2 R38.2
+16.8(2)V: C25.1 C30.1 C31.1 C32.1 C34.1 C35.1 C36.1 C41.1 C67.1 L3.P$2 Q6.1(S) Q6.2(S) Q6.3(S) Q11.1(S) Q11.2(S) Q11.3(S) Q14.1(S) Q14.2(S) Q14.3(S) R20.2 R27.2 R28.2 R42.2 R58.2
+24V: C3.1 C4.1 C5.1 C6.1 C21.1 C22.1 C26.1 C27.1 C42.1 C43.1 C45.1 C46.1 C47.1 C50.1 C51.1 C68.1 C69.1 C70.1 C71.1 C81.1 C82.1 F1.2 Q3.2(D1) Q3.3(D1) Q3.4(D1) Q3.EP1@1(D1) Q3.EP1@2(D1) Q7.2(D1) Q7.3(D1) Q7.4(D1) Q7.EP1@1(D1) Q7.EP1@2(D1) Q13.2(D1) Q13.3(D1) Q13.4(D1) Q13.EP1@1(D1) Q13.EP1@2(D1) Q16.2(D1) Q16.3(D1) Q16.4(D1) Q16.EP1@1(D1) Q16.EP1@2(D1) Q17.2(D1) Q17.3(D1) Q17.4(D1) Q17.EP1@1(D1) Q17.EP1@2(D1) R5.1 R21.1 R46.1 R47.1 R62.1 U11.1(VIN)
BATT1: D1.C F2.1 P2.1 R36.2
BATT1_CURR_SENSE: U1.1(VOUT) U3.13(RC2/AN14/C[5,6]IN2-/T5CKI/IOCC2)
BATT1_SRC1: Q2.1(G) R6.2 U3.9(RA7/CLKIN/OSC1/IOCA7)
BATT1_V_SENSE: C102.1 R36.1 R37.2 U3.23(RB2/AN8/OPAIN0-/DAC3OUT1/IOCB2)
BATT2: D4.C F3.1 P6.1 R54.2
BATT2_CURR_SENSE: U3.14(RC3/AN15/C[5,6]IN2-/T5CKI/IOCC2) U4.1(VOUT)
BATT2_SRC1: Q5.1(G) R17.2 U3.10(RA6/CLKOUT/C6IN1+/OSC2/IOCA6)
BATT2_SRC2: Q8.1(G) R29.2 U3.12(RC1/DAC7OUT1/IOCC1)
BATT2_V_SENSE: C103.1 R54.1 R67.2 U3.22(RB1/AN10/PRG1IN[0,1]/HIB1/C[1-4]IN3-/OPA2OUT/OPAIN1[+,-]/IOCB1)
BATT3: D8.C F4.1 P8.1 R74.2
BATT3_CURR_SENSE: U3.3(RA1/AN1/PRG1IN0/IOCA1/C[1-4]IN1-) U6.1(VOUT)
BATT3_SRC1: Q10.1(G) R41.2 U3.6(RA4/OPA1IN0+/DAC4OUT1/T0CKI/IOCA4)
BATT3_SRC2: Q12.1(G) R45.2 U3.5(RA3/AN3/VREF+/DAC[1-7]REF0+/C1IN1+/IOCA3)
BATT3_V_SENSE: C104.1 R74.1 R75.2 U3.25(RB4/AN11/C3IN1+/T5G/IOCB4)
BATT4: D12.C F5.1 P12.1 R76.2
BATT4_CURR_SENSE: U3.2(RA0/AN0/IOCA0/C[1-6]IN0-) U9.1(VOUT)
BATT4_SRC2: Q15.1(G) R63.2 U3.26(RB5/AN13/DAC[5,7]REF1-/C4IN2-/T1G/IOCB5)
BATT4_V_SENSE: C105.1 R76.1 R77.2 U3.24(RB3/AN9/C[1-3]IN2-/OPA2IN0+/IOCB3)
CONTROLLER_ADJ_DAC: C109.1 U3.11(RC0/DAC5OUT1/T1CKI/T3CKI/T3G/IOCC0) U16.1(IN+)
CONTROLLER_CURR_SENSE: U3.18(RC7/AN19/OPA3IN0-/IOCC7) U15.1(VOUT)
CONTROLLER_EN: R71.2 U3.15(RC4/AN16/C[5,6]IN3-/T8IN/IOCC4) U7.1(!SHDN)
CONTROLLER_V_SENSE: C44.1 R72.1 R73.2 U3.21(RB0/AN12/ZCD/HIB0/C2IN1+/IOCB0)
GND: C1.2 C3.2 C4.2 C5.2 C6.2 C7.2 C9.2 C10.2 C11.2 C13.2 C14.2 C15.2 C19.2 C20.2 C21.2 C22.2 C23.2 C24.2 C26.2 C27.2 C28.2 C30.2 C31.2 C32.2 C34.2 C35.2 C36.2 C40.2 C42.2 C43.2 C44.2 C45.2 C46.2 C47.2 C48.2 C50.2 C51.2 C52.2 C55.2 C56.2 C57.2 C60.2 C61.2 C62.2 C66.2 C68.2 C69.2 C70.2 C71.2 C72.2 C74.2 C75.2 C76.2 C78.2 C79.2 C80.2 C81.2 C82.2 C83.2 C84.2 C85.2 C87.2 C89.2 C90.2 C91.2 C92.2 C93.2 C94.2 C95.2 C96.2 C97.2 C98.2 C99.2 C100.2 C101.2 C102.2 C103.2 C104.2 C105.2 C106.2 C107.2 C108.2 C109.2 C110.- C111.2 C112.2 D1.A D2.A D4.A D8.A D9.A D10.A D11.A D12.A J1.3(GND) J2.1 J2.2 J2.3 J2.4 P1.1 P4.1 P5.1 P7.1 P10.1 P11.1 Q2.2(S) Q3.5(S2) Q3.6(S2) Q3.7(S2) Q5.2(S) Q7.5(S2) Q7.6(S2) Q7.7(S2) Q8.2(S) Q10.2(S) Q12.2(S) Q13.5(S2) Q13.6(S2) Q13.7(S2) Q15.2(S) Q16.5(S2) Q16.6(S2) Q16.7(S2) Q17.5(S2) Q17.6(S2) Q17.7(S2) R2.1 R6.1 R10.1 R13.1 R15.1 R17.1 R29.1 R30.1 R34.1 R37.1 R39.1 R41.1 R45.1 R49.1 R53.1 R57.1 R59.1 R63.1 R66.1 R67.1 R70.1 R71.1 R73.1 R75.1 R77.1 U1.2(GND) U2.EP(GND) U3.8(VSS) U3.19(VSS) U4.2(GND) U5.EP(GND) U6.2(GND) U7.EP(GND) U8.EP(GND) U9.2(GND) U10.EP(GND) U11.4(GND/ADJ) U12.2(V-) U13.2(V-) U14.4(GND/ADJ) U15.2(GND) U16.2(V-)
N$1: C7.1 R5.2 R7.2 U2.4(VIN)
N$2: C111.1 R7.1 U2.1(!SHDN)
N$3: C52.1 R46.2 U8.4(VIN)
N$4: C92.1 U2.6(VCC)
N$5: D5.A@1(A) D5.A@2(A) Q6.5(D) Q6.6(D) Q6.7(D) Q6.8(D) Q6.EP(D) R10.2
N$6: C8.1 U2.8(BOOT)
N$7: C8.2 L1.P$1 Q3.EP2(S1D2) U2.9(PHASE)
N$8: Q3.1(G1) U2.10(HDRV)
N$9: Q3.8(G2) U2.7(LDRV)
N$10: J1.2(VCC) R68.1
N$11: R31.2 U12.3(IN-) U12.4(OUT)
N$12: C87.1 U11.3(VOUT) U14.1(VIN)
N$13: C54.1 U8.8(BOOT)
N$14: C54.2 L5.1 Q13.EP2(S1D2) U8.9(PHASE)
N$15: Q13.8(G2) U8.7(LDRV)
N$16: Q13.1(G1) U8.10(HDRV)
N$17: C12.2 C17.2 R9.1 R11.1 R12.2 R31.1 U2.2(FB)
N$18: R12.1 R13.2
N$19: C12.1 R8.1
N$20: C59.2 C65.2 R52.1 R56.1 R57.2 U8.2(FB)
N$21: C72.1 R62.2 U10.4(VIN)
N$22: C59.1 R50.1
N$23: C64.1 C65.1 U8.3(COMP)
N$24: C64.2 R56.2
N$25: C48.1 R47.2 U7.4(VIN)
N$26: D3.A@1(A) D3.A@2(A) Q4.5(D) Q4.6(D) Q4.7(D) Q4.8(D) Q4.EP(D) R15.2
N$27: F3.2 R26.1 U4.4(VM)
N$28: C73.1 U10.8(BOOT)
N$29: J2.8 R78.2
N$30: C73.2 L6.1 Q16.EP2(S1D2) U10.9(PHASE)
N$31: Q16.8(G2) U10.7(LDRV)
N$32: C49.1 U7.8(BOOT)
N$33: C49.2 L4.1 Q17.EP2(S1D2) U7.9(PHASE)
N$34: Q17.8(G2) U7.7(LDRV)
N$35: Q17.1(G1) U7.10(HDRV)
N$36: J2.7 R81.2
N$37: C53.1 R51.1
N$38: C58.1 C63.1 U7.3(COMP)
N$39: C58.2 R55.2
N$40: C2.2 Q1.4(G) R1.1 R3.2
N$41: Q2.3(D) R3.1
N$42: C16.1 C17.1 U2.3(COMP)
N$43: C18.2 Q4.4(G) R14.1 R16.2
N$44: C16.2 R11.2
N$45: C28.1 R21.2 R23.2 U5.4(VIN)
N$46: C112.1 R23.1 U5.1(!SHDN)
N$47: C95.1 U10.6(VCC)
N$48: C107.1 U7.6(VCC)
N$49: J2.6 R78.1
N$50: C29.2 L3.P$1 Q7.EP2(S1D2) U5.9(PHASE)
N$51: Q7.8(G2) U5.7(LDRV)
N$52: Q7.1(G1) U5.10(HDRV)
N$53: C33.2 C38.2 R28.1 R32.1 R33.2 R35.1 U5.2(FB)
N$54: R33.1 R34.2
N$55: C33.1 R27.1
N$56: C37.1 C38.1 U5.3(COMP)
N$57: C37.2 R32.2
N$58: Q16.1(G1) U10.10(HDRV)
N$59: C77.2 C88.2 R65.1 R69.1 R70.2 U10.2(FB)
N$60: Q5.3(D) R16.1
N$61: C25.2 Q6.4(G) R20.1 R24.2
N$62: Q8.3(D) R24.1
N$63: C39.2 Q9.4(G) R38.1 R40.2
N$64: Q10.3(D) R40.1
N$65: C41.2 Q11.4(G) R42.1 R43.2
N$66: Q12.3(D) R43.1
N$67: C67.2 Q14.4(G) R58.1 R60.2
N$68: Q15.3(D) R60.1
N$69: C77.1 R64.1
N$70: C86.1 C88.1 U10.3(COMP)
N$71: C86.2 R69.2
N$75: C83.1 C84.1 C91.1 C106.1 D16.A@1(A) D16.A@2(A) L4.2 R48.2 R51.2
N$76: R22.1 U3.27(RB6/DAC[5,7]REF1+/C4IN1+/ICSPCLK)
N$77: C19.1 C20.1 L2.2 U3.20(VDD)
N$78: R19.2 U3.1(RE3/!MCLR)
N$79: R25.1 U3.28(RB7/C5IN1+/DAC[1-7]OUT2/T6IN/ICSPDAT)
N$80: D6.C R4.2 U1.3(VP)
N$81: D7.C D13.C R44.2 U6.3(VP)
N$82: D3.C D5.C R26.2 U4.3(VP)
N$83: D14.C R61.2 U9.3(VP)
N$85: D16.C R79.2 U15.3(VP)
N$86: C29.1 U5.8(BOOT)
N$87: C93.1 U5.6(VCC)
N$88: C94.1 U8.6(VCC)
N$89: R35.2 U13.3(IN-) U13.4(OUT)
N$90: F6.2 R79.1 U15.4(VM)
N$91: D6.A@1(A) D6.A@2(A) Q1.5(D) Q1.6(D) Q1.7(D) Q1.8(D) Q1.EP(D) R2.2
N$92: D7.A@1(A) D7.A@2(A) Q9.5(D) Q9.6(D) Q9.7(D) Q9.8(D) Q9.EP(D) R39.2
N$93: D13.A@1(A) D13.A@2(A) Q11.5(D) Q11.6(D) Q11.7(D) Q11.8(D) Q11.EP(D) R30.2
N$94: D14.A@1(A) D14.A@2(A) Q14.5(D) Q14.6(D) Q14.7(D) Q14.8(D) Q14.EP(D) R59.2
N$95: C53.2 C63.2 R48.1 R49.2 R55.1 R80.1 U7.2(FB)
N$96: F4.2 R44.1 U6.4(VM)
N$97: F5.2 R61.1 U9.4(VM)
N$98: F2.2 R4.1 U1.4(VM)
N$99: R80.2 U16.3(IN-) U16.4(OUT)
N$100: J2.5 R81.1
PGC: J1.5(ICSPCLK) R22.2
PGD: J1.4(ICSPDAT) R25.2
PWR_IN: C110.+ D2.C F1.1 P3.1
USB1_EN: R53.2 U3.17(RC6/AN18/PRG3IN0/C[5,6]IN1-/OPA3OUT/IOCC6) U8.1(!SHDN)
USB2_EN: R66.2 U3.16(RC5/AN17/OPA3IN0+/T4IN/IOCC5) U10.1(!SHDN)
V1_ADJ_DAC: C98.1 U3.7(RA5/AN4/OPA1IN0-/DAC2OUT1/IOCA5) U12.1(IN+)
V2_ADJ_DAC: C101.1 U3.4(RA2/AN2/VREF-/DAC[1-7]REF0-/DAC1OUT1/IOCA2) U13.1(IN+)
Unconnected: U2.5(PWRGD) U5.5(PWRGD) U7.5(PWRGD) U8.5(PWRGD) U10.5(PWRGD)

## Notes on the sheet
- CHANGES:
  1. 10uF 35V in 0805 and 1206 packages are about the same price. Might as well change all 1206's to 0805's here.
- CS30 amplifies voltage drop across sense resistor:
        Vout = Gain * Rsense * Iload
        Gain = 100 (for CS30CL)
  
  Output swing is restricted to 0.1mV to Vcc-1V.
  Therefore, with VCC=5V and Rsense=10mOhm,
  CS30 cannot detect true zero current or current
  above 4A.
  
  Iload    Vout
  5.5A     4V
  5.0A     4V
  4.0A     4V
  3.0A     3V
  2.0A     2V
  1.0A     1V
  0.2A     0.2V
  0.1A     0.1V
  0.0A     0.1V
- 16.8V for Solo Batteries
- MCU and PWR IN | BATT1
- 6A Fuse
  Fast Blow
- 18uH
   4.6A
  35mOhm
- 20V in
  5V out
- The MCP19035 has an internally timed soft start,
  but then both 16.8V sources start up at the same
  time. Put different RCs on the SHDN pin so they
  start up differently.
- 220uF
- BATT2
- 10uH
- DAC signal adjusts current flow in resistor
  divider to adjust output voltage of regulator
  by small amounts
  
  Vout = (Vfb*R1)/R2 + (0.6*R1-Vdac*R1)/R3 + 0.6
  R1 -> Top resistor
  R2 -> Bottom resistor
  R3 -> Op Amp resistor
  
  When Vdac is set to Vfb (0.6V), output of
  regulator is unaffected by op amp. Raising Vdac
  will lower output of regulator.
- 18uH
   4.6A
  35mOhm
- ICSP Connector
- 20V in
  5V out
- DAC signal adjusts current flow in resistor
  divider to adjust output voltage of regulator
  by small amounts
- BATT3
- 5V for USB | 8.3V for Hand Controller | 5V for Logic
- Assuming all devices on board will draw no more than 100mA, the total power wasted
  in an LDO is (24V-5V)*100mA = 1.9W. Split the heat dissipation between two bodies
  by using one LDO to drop from 24V to 12V and a second LDO to drop from 12V to 5V.
- 12V
- 18uH
   3.8A
  43mOhm
- 33uH
   2.8A
  72mOhm
- 20V in
  5V out
- 10V in
  5V out
- BATT4
- 18uH
   3.8A
  43mOhm
- 20V in
  5V out

## Library data of the parts
C1-C109 C111 C112 = dan:CAP
C110 = dan:CAP_POL
D1 D2 D4 D8-D12 = dan:ZENER
D3 D5-D7 D13 D14 D16 = dan:DIODE
F1-F6 = dan:FUSE
J1 = dan:PIC_ICSP_5PIN
J2 = dan:CON_10PIN
L1-L6 = dan:INDUCTOR
P1-P12 = dan:SOLDER_PAD
Q1 Q4 Q6 Q9 Q11 Q14 = dan:PMOS
Q2 Q5 Q8 Q10 Q12 Q15 = dan:NMOS
Q3 Q7 Q13 Q16 Q17 = dan:NMOS_HALFBRIDGE
R1-R81 = dan:RESISTOR
U1 U4 U6 U9 U15 = dan:CS30
U2 U5 U7 U8 U10 = dan:MCP19035
U3 = dan:16F1773/6/7/8/9
U11 U14 = dan:LDO
U12 U13 U16 = dan:OP-AMP